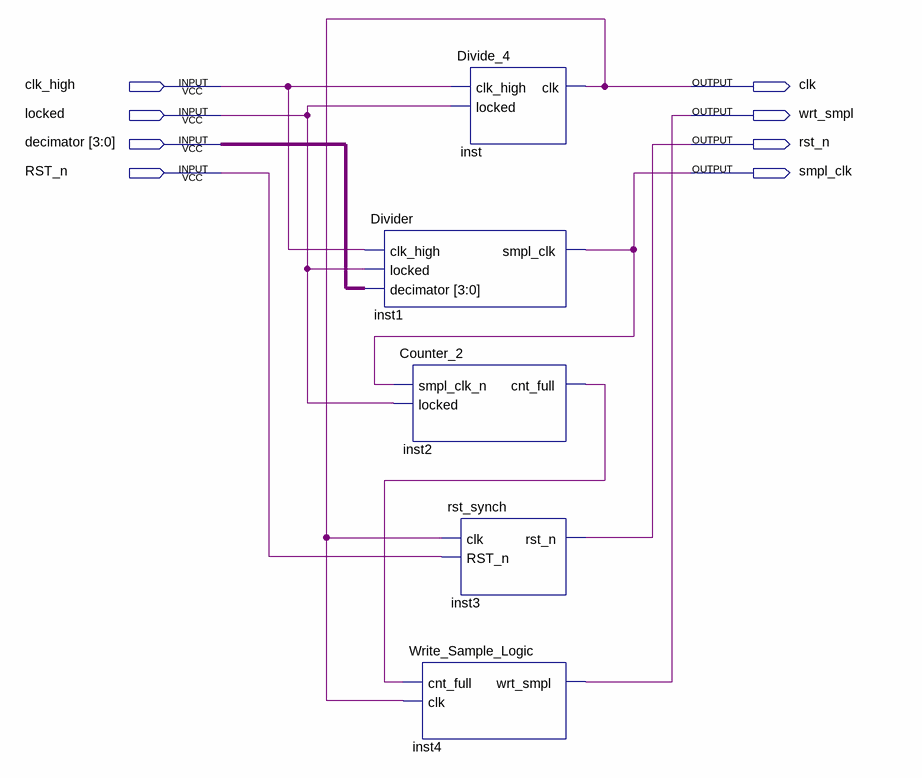
[diagram p0: schematic sheet]
// Quartus schematic CH_SMP_Upper.bdf as structural Verilog: 5 symbols, 8 pins
module CH_SMP_Upper (
  input  clk_high,
  input  locked,
  input  [3:0] decimator,
  inout  RST_n,
  output clk,
  output wrt_smpl,
  output smpl_clk
);

  wire inst2_cnt_full;

  Divider inst1 (.clk_high(clk_high), .locked(locked), .decimator(decimator), .smpl_clk(smpl_clk));
  Divide_4 inst (.clk_high(clk_high), .locked(locked), .clk(clk));
  Counter_2 inst2 (.smpl_clk_n(smpl_clk), .locked(locked), .cnt_full(inst2_cnt_full));
  rst_synch inst3 (.clk(clk), .RST_n(RST_n), .rst_n(RST_n));
  Write_Sample_Logic inst4 (.cnt_full(inst2_cnt_full), .clk(clk), .wrt_smpl(wrt_smpl));
endmodule
